# Altium schematic sheet radio_high.SchDoc
size A3
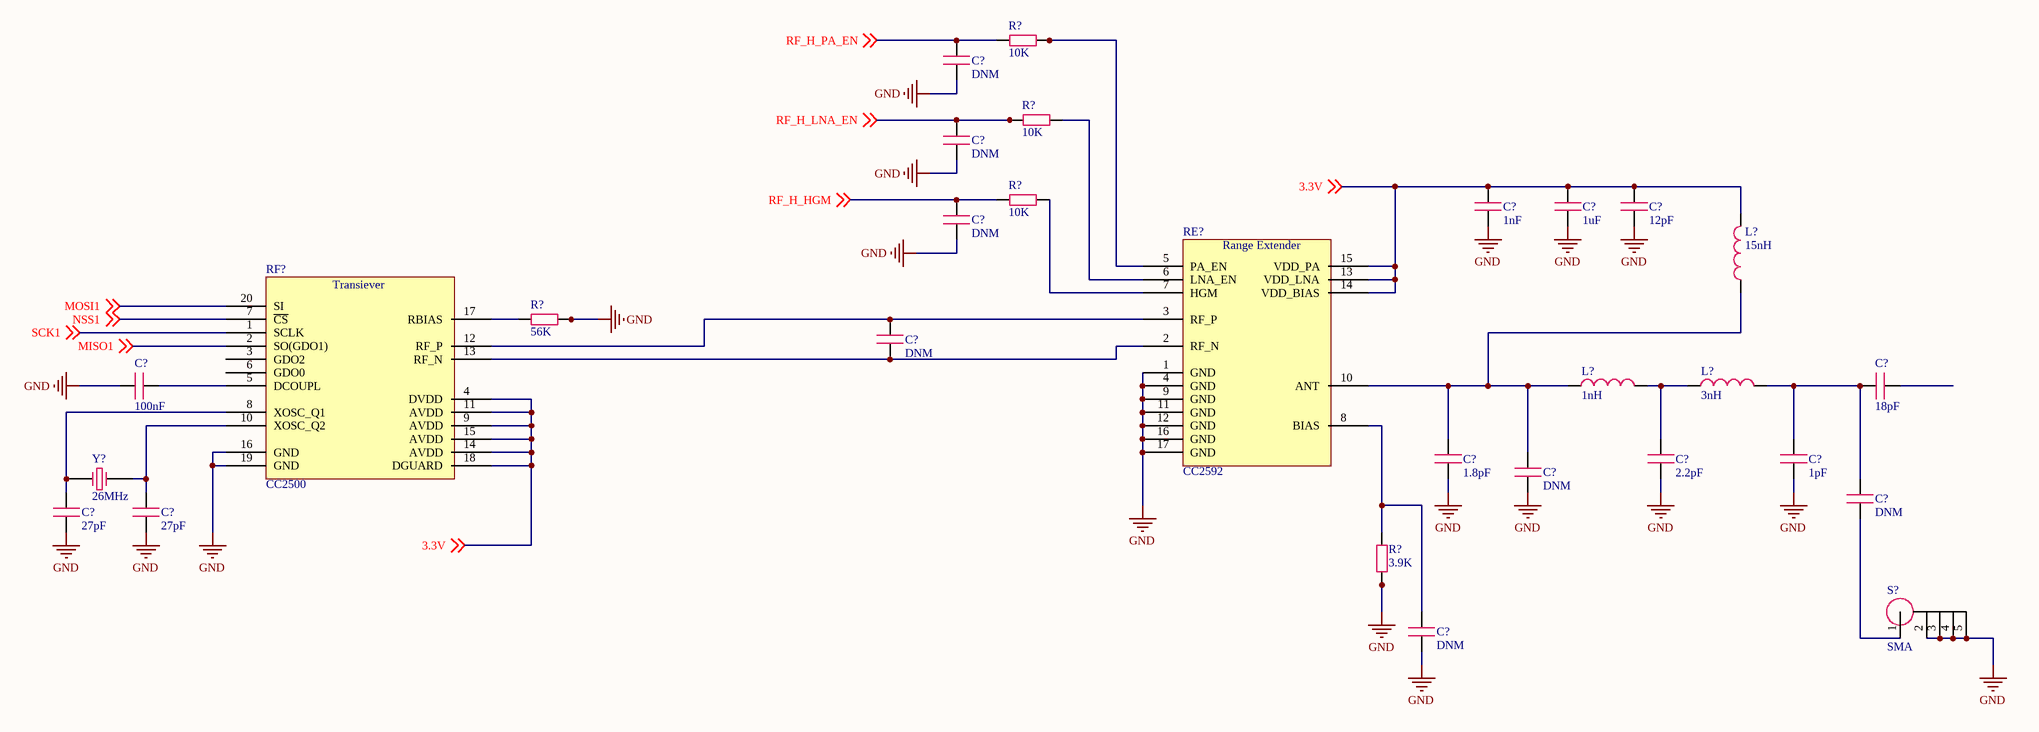
[diagram p0: radio_high.SchDoc]

## Parts
(Parts that share a designator on the sheet are numbered #1, #2 ... from top to bottom, then left to right.)
C?#1  value DNM  [C0402]  (hidden comment: Capacity)
C?#2  value DNM  [C0402]  (hidden comment: Capacity)
C?#3  value 1nF  [C0402]  (hidden comment: Capacity)
C?#4  value 1uF  [C0402]  (hidden comment: Capacity)
C?#5  value 12pF  [C0402]  (hidden comment: Capacity)
C?#6  value DNM  [C0402]  (hidden comment: Capacity)
C?#7  value DNM  [C0402]  (hidden comment: Capacity)
C?#8  value 100nF  [C0402]  (hidden comment: Capacity)
C?#9  value 18pF  [C0402]  (hidden comment: Capacity)
C?#10  value 1.8pF  [C0402]  (hidden comment: Capacity)
C?#11  value 2.2pF  [C0402]  (hidden comment: Capacity)
C?#12  value 1pF  [C0402]  (hidden comment: Capacity)
C?#13  value DNM  [C0402]  (hidden comment: Capacity)
C?#14  value DNM  [C0402]  (hidden comment: Capacity)
C?#15  value 27pF  [C0402]  (hidden comment: Capacity)
C?#16  value 27pF  [C0402]  (hidden comment: Capacity)
C?#17  value DNM  [C0402]  (hidden comment: Capacity)
L?#1  value 15nH  [L0402]  (hidden comment: Inductor)
L?#2  value 1nH  [L0402]  (hidden comment: Inductor)
L?#3  value 3nH  [L0402]  (hidden comment: Inductor)
R?#1  value 10K  [R0402]  (hidden comment: Resistor)
R?#2  value 10K  [R0402]  (hidden comment: Resistor)
R?#3  value 10K  [R0402]  (hidden comment: Resistor)
R?#4  value 56K  [R0402]  (hidden comment: Resistor)
R?#5  value 3.9K  [R0402]  (hidden comment: Resistor)
RE?  CC2592  [RGV16_2P16X2P16]
RF?  CC2500  [RTK20_2P4X2P4]
S?  SMA  [19-46-2_A]
Y?  Frequency: 26MHz  (hidden comment: Crystall)

## Nets
GND: C?#1.1 C?#2.1 C?#3.1 C?#4.1 C?#5.1 C?#6.1 C?#8.1 C?#10.1 C?#11.1 C?#12.1 C?#13.1 C?#15.2 C?#16.2 C?#17.1 R?#4.2 R?#5.1 RE?.1(GND) RE?.4(GND) RE?.9(GND) RE?.11(GND) RE?.12(GND) RE?.16(GND) RE?.17(GND) RF?.16(GND) RF?.19(GND) S?.2 S?.3 S?.4 S?.5
3.3V: C?#3.2 C?#4.2 C?#5.2 L?#1.2 RE?.13(VDD_LNA) RE?.14(VDD_BIAS) RE?.15(VDD_PA) RF?.4(DVDD) RF?.9(AVDD) RF?.11(AVDD) RF?.14(AVDD) RF?.15(AVDD) RF?.18(DGUARD) ; off-sheet 3.3V
MISO1: RF?.2(SO(GDO1)) ; off-sheet MISO1
MOSI1: RF?.20(SI) ; off-sheet MOSI1
NSS1: RF?.7(~{CS}) ; off-sheet NSS1
RF_H_HGM: C?#6.2 R?#3.1 ; off-sheet RF_H_HGM
RF_H_LNA_EN: C?#2.2 R?#2.1 ; off-sheet RF_H_LNA_EN
RF_H_PA_EN: C?#1.2 R?#1.1 ; off-sheet RF_H_PA_EN
SCK1: RF?.1(SCLK) ; off-sheet SCK1
NetC?#7_1: C?#7.1 RE?.2(RF_N) RF?.13(RF_N)
NetC?#7_2: C?#7.2 RE?.3(RF_P) RF?.12(RF_P)
NetC?#8_2: C?#8.2 RF?.5(DCOUPL)
NetC?#9_2: C?#9.2 C?#12.2 C?#14.2 L?#3.2
NetC?#10_2: C?#10.2 C?#13.2 L?#1.1 L?#2.1 RE?.10(ANT)
NetC?#11_2: C?#11.2 L?#2.2 L?#3.1
NetC?#14_1: C?#14.1 S?.1
NetC?#15_1: C?#15.1 RF?.8(XOSC_Q1) Y?.1(OSC1)
NetC?#16_1: C?#16.1 RF?.10(XOSC_Q2) Y?.2(OSC2)
NetC?#17_2: C?#17.2 R?#5.2 RE?.8(BIAS)
NetR?#1_2: R?#1.2 RE?.5(PA_EN)
NetR?#2_2: R?#2.2 RE?.6(LNA_EN)
NetR?#3_2: R?#3.2 RE?.7(HGM)
NetR?#4_1: R?#4.1 RF?.17(RBIAS)

Not connected (* = marked no-connect by the designer): C?#9 1; RF? 3(GDO2) 6(GDO0)

## Notes on the sheet
- (in symbol CC2500) Transiever
- (in symbol CC2592) Range Extender

## Library data of the parts
RE? = CC2592: Range Extender 2.5GHz
RF? = CC2500: 2.4GHz transiever
S? = SMA: Antenna connector
Y? = Crystall: Epson TSX-3225 MHz Crystal